# Altium schematic sheet roach2_top.SchDoc: Design Toplevel
size A3; Date: DO NOT USE, RATHER USE PROJ OPTIONS; DrawnBy: DO NOT USE, RATHER USE PROJ OPTIONS; Engineer: DO NOT USE, RATHER USE PROJ OPTIONS; Organization: DO NOT USE, RATHER USE PROJ OPTIONS; DocumentNumber: DO NOT USE, RATHER USE PROJ OPTIONS; Revision: DO NOT USE, RATHER USE PROJ OPTIONS; SheetNumber: 1; SheetTotal: 27; SCH_Sheet_Filename: <roach2_top.SchDoc>; CurrentTime: DO NOT USE, RATHER USE PROJ OPTIONS; Time: DO NOT USE, RATHER USE PROJ OPTIONS; DocumentFullPathAndName: DO NOT USE, RATHER USE PROJ OPTIONS; DocumentName: DO NOT USE, RATHER USE PROJ OPTIONS; ModifiedDate: DO NOT USE, RATHER USE PROJ OPTIONS; ImagePath: DO NOT USE, RATHER USE PROJ OPTIONS
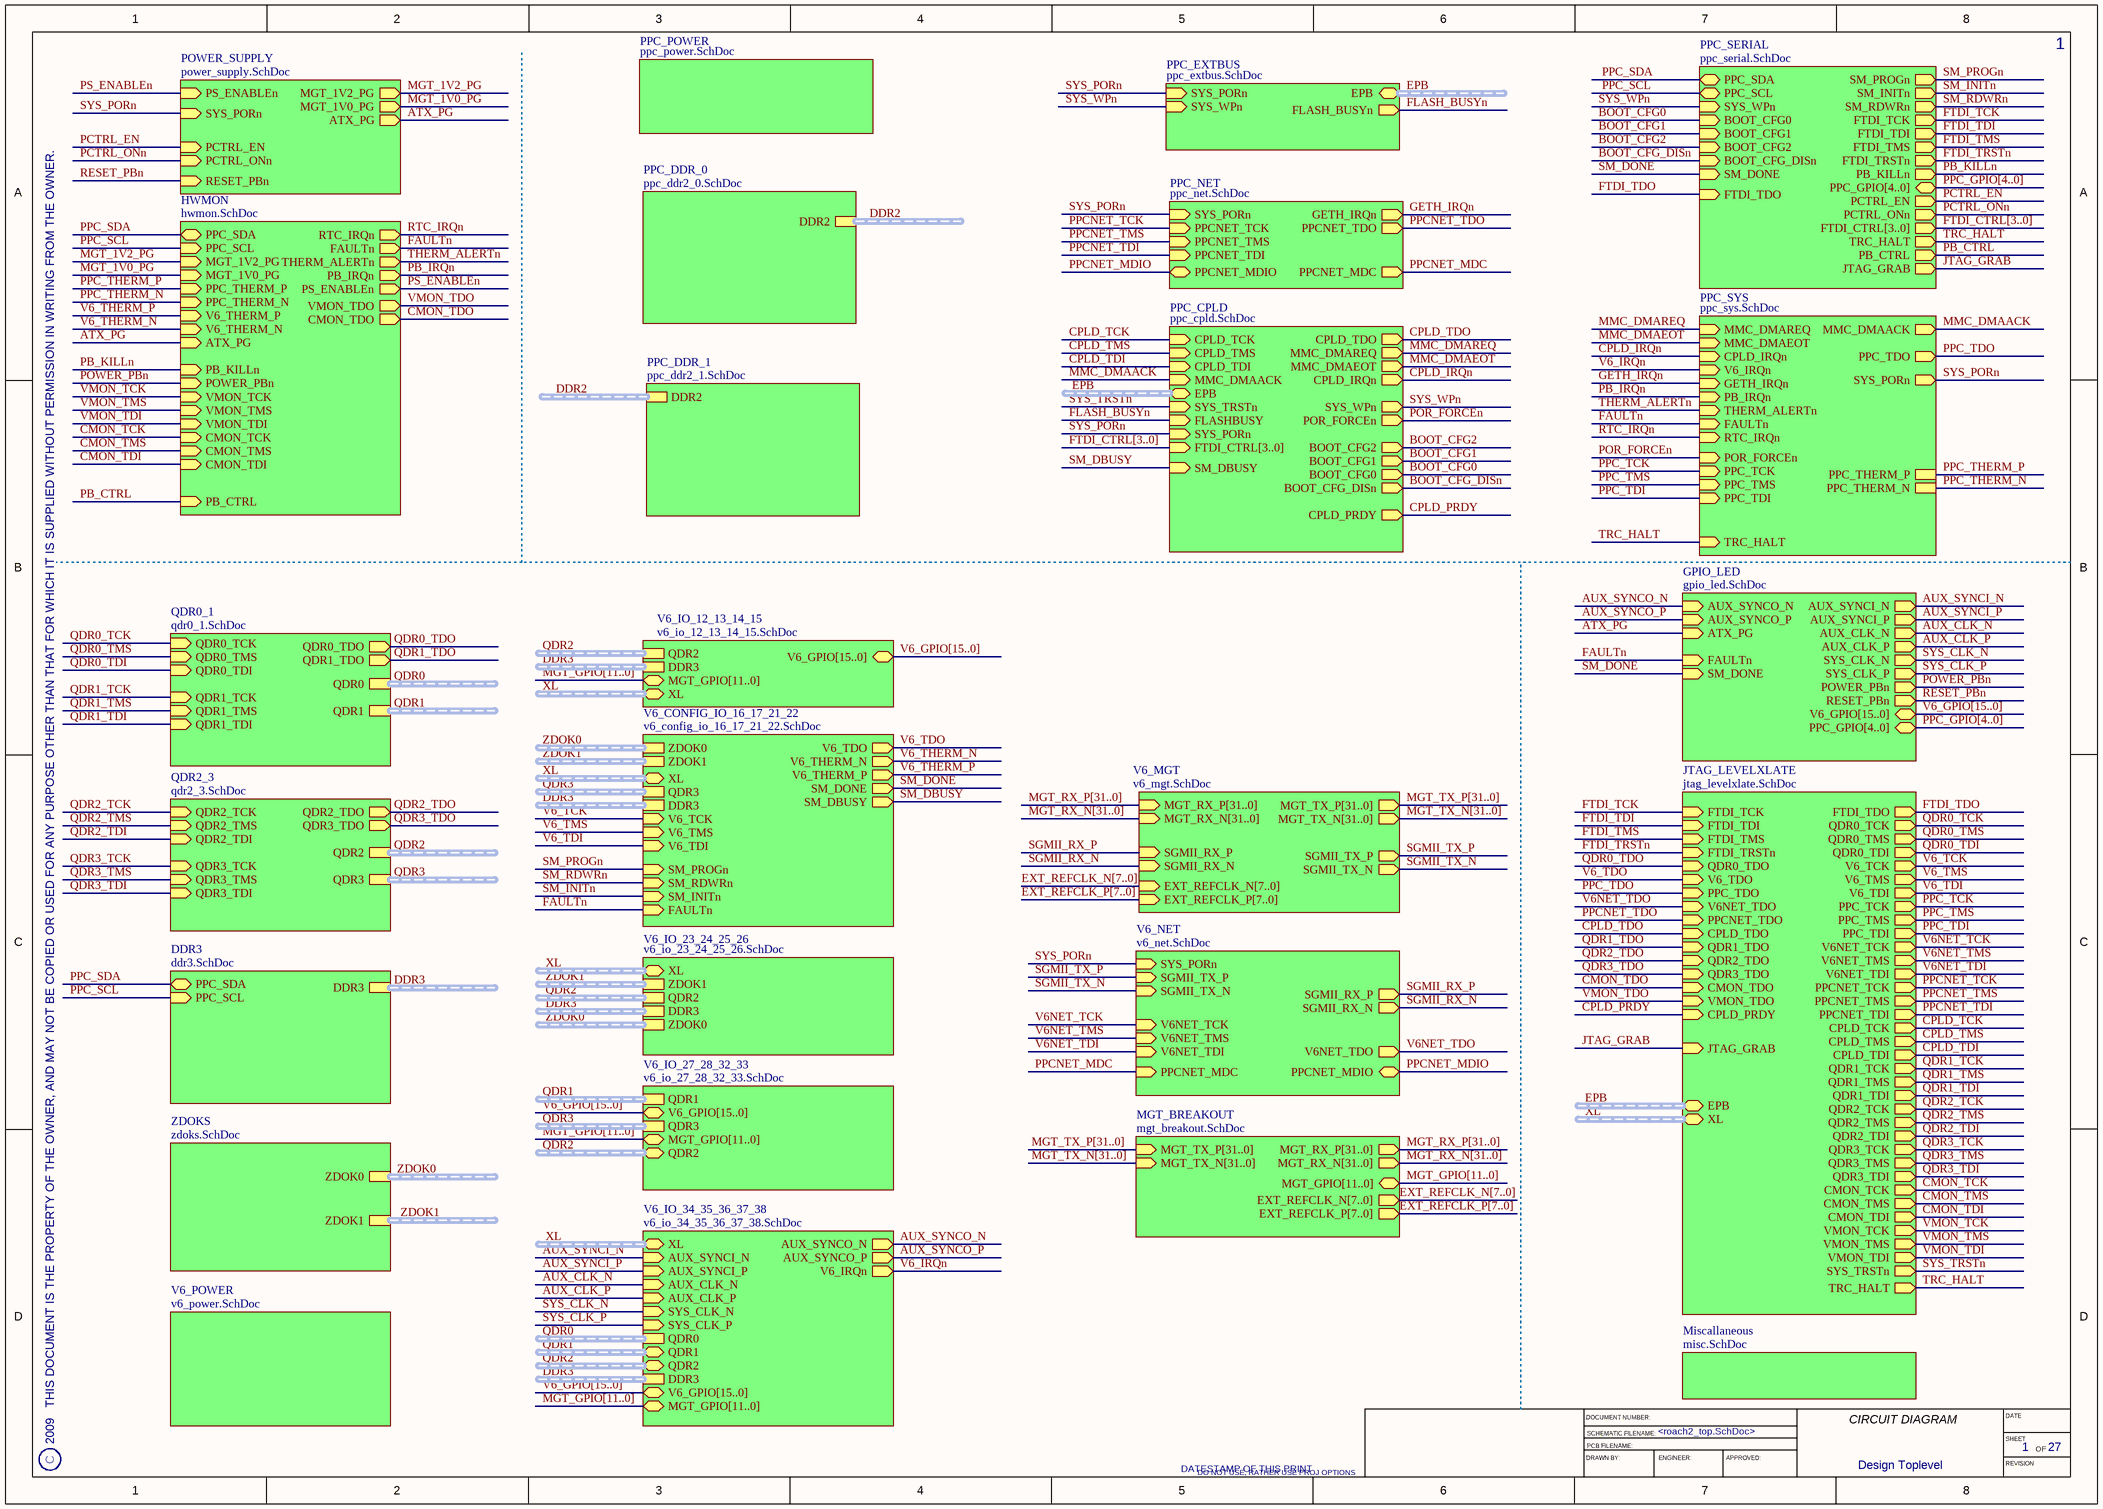
[diagram p0: roach2_top.SchDoc]

## Sub-sheets
DDR3 = ddr3.SchDoc: DDR3 (harness DDR3), PPC_SDA (bidir), PPC_SCL (in)
GPIO_LED = gpio_led.SchDoc: V6_GPIO[15..0] (bidir), AUX_SYNCO_N (in), AUX_SYNCO_P (in), AUX_SYNCI_N (out), AUX_SYNCI_P (out), AUX_CLK_N (out), AUX_CLK_P (out), POWER_PBn (out), ATX_PG (in), RESET_PBn (out), PPC_GPIO[4..0] (bidir), SYS_CLK_N (out), SYS_CLK_P (out), SM_DONE (in), FAULTn (in)
HWMON = hwmon.SchDoc: PPC_SDA (bidir), PPC_SCL (in), RTC_IRQn (out), MGT_1V2_PG (in), MGT_1V0_PG (in), PPC_THERM_P (in), PPC_THERM_N (in), V6_THERM_P (in), V6_THERM_N (in), FAULTn (out), THERM_ALERTn (out), ATX_PG (in), PB_IRQn (out), PB_KILLn (in), POWER_PBn (in), PS_ENABLEn (out), VMON_TDO (out), CMON_TDO (out), VMON_TCK (in), VMON_TMS (in), VMON_TDI (in), CMON_TCK (in), CMON_TMS (in), CMON_TDI (in), PB_CTRL (in)
JTAG_LEVELXLATE = jtag_levelxlate.SchDoc: FTDI_TCK (in), FTDI_TDI (in), FTDI_TMS (in), FTDI_TRSTn (in), FTDI_TDO (out), QDR0_TCK (out), QDR0_TMS (out), QDR0_TDI (out), QDR0_TDO (in), V6_TCK (out), V6_TDI (out), V6_TMS (out), V6_TDO (in), PPC_TDI (out), PPC_TDO (in), PPC_TMS (out), PPC_TCK (out), V6NET_TDI (out), V6NET_TDO (in), V6NET_TCK (out), V6NET_TMS (out), PPCNET_TDI (out), PPCNET_TDO (in), PPCNET_TCK (out), PPCNET_TMS (out), CPLD_TDI (out), CPLD_TDO (in), CPLD_TCK (out), CPLD_TMS (out), QDR1_TCK (out), QDR1_TMS (out), QDR1_TDI (out), QDR1_TDO (in), QDR2_TCK (out), QDR2_TMS (out), QDR2_TDI (out), QDR2_TDO (in), QDR3_TCK (out), QDR3_TMS (out), QDR3_TDI (out), QDR3_TDO (in), SYS_TRSTn (out), CMON_TMS (out), VMON_TMS (out), CMON_TCK (out), VMON_TCK (out), CMON_TDO (in), VMON_TDO (in), CMON_TDI (out), VMON_TDI (out), EPB (harness EPB), XL (harness XL), CPLD_PRDY (in), TRC_HALT (out), JTAG_GRAB (in)
MGT_BREAKOUT = mgt_breakout.SchDoc: MGT_RX_P[31..0] (out), MGT_RX_N[31..0] (out), MGT_TX_P[31..0] (in), MGT_TX_N[31..0] (in), MGT_GPIO[11..0] (bidir), EXT_REFCLK_N[7..0] (out), EXT_REFCLK_P[7..0] (out)
Miscallaneous = misc.SchDoc: no entries
POWER_SUPPLY = power_supply.SchDoc: PS_ENABLEn (in), MGT_1V2_PG (out), MGT_1V0_PG (out), ATX_PG (out), SYS_PORn (in), PCTRL_EN (in), PCTRL_ONn (in), RESET_PBn (in)
PPC_CPLD = ppc_cpld.SchDoc: CPLD_TDI (in), CPLD_TDO (out), CPLD_TCK (in), CPLD_TMS (in), MMC_DMAREQ (out), MMC_DMAACK (in), MMC_DMAEOT (out), CPLD_IRQn (out), SYS_TRSTn (in), SYS_WPn (out), FLASHBUSY (in), POR_FORCEn (out), BOOT_CFG_DISn (out), BOOT_CFG2 (out), BOOT_CFG1 (out), BOOT_CFG0 (out), SYS_PORn (in), EPB (harness EPB), FTDI_CTRL[3..0] (in), CPLD_PRDY (out), SM_DBUSY (in)
PPC_DDR_0 = ppc_ddr2_0.SchDoc: DDR2 (harness DDR2)
PPC_DDR_1 = ppc_ddr2_1.SchDoc: DDR2 (harness DDR2)
PPC_EXTBUS = ppc_extbus.SchDoc: SYS_PORn (in), SYS_WPn (in), FLASH_BUSYn (out), EPB (harness EPB)
PPC_NET = ppc_net.SchDoc: SYS_PORn (in), GETH_IRQn (out), PPCNET_TDI (in), PPCNET_TDO (out), PPCNET_TCK (in), PPCNET_TMS (in), PPCNET_MDIO (bidir), PPCNET_MDC (out)
PPC_POWER = ppc_power.SchDoc: no entries
PPC_SERIAL = ppc_serial.SchDoc: PPC_SDA (bidir), PPC_SCL (bidir), SYS_WPn (in), BOOT_CFG0 (in), BOOT_CFG1 (in), BOOT_CFG2 (in), BOOT_CFG_DISn (in), SM_PROGn (out), SM_INITn (out), SM_RDWRn (out), FTDI_TCK (out), FTDI_TDI (out), FTDI_TDO (in), FTDI_TMS (out), FTDI_TRSTn (out), PPC_GPIO[4..0] (bidir), SM_DONE (in), PCTRL_EN (out), PCTRL_ONn (out), PB_KILLn (out), FTDI_CTRL[3..0] (out), TRC_HALT (out), PB_CTRL (out), JTAG_GRAB (out)
PPC_SYS = ppc_sys.SchDoc: MMC_DMAREQ (in), MMC_DMAACK (out), MMC_DMAEOT (in), CPLD_IRQn (in), V6_IRQn (in), GETH_IRQn (in), THERM_ALERTn (in), PPC_THERM_P, PPC_THERM_N, POR_FORCEn (in), PPC_TCK (in), PPC_TDO (out), PPC_TMS (in), PPC_TDI (in), FAULTn (in), SYS_PORn (out), PB_IRQn (in), RTC_IRQn (in), TRC_HALT (in)
QDR0_1 = qdr0_1.SchDoc: QDR0 (harness QDR0), QDR0_TCK (in), QDR0_TMS (in), QDR0_TDI (in), QDR0_TDO (out), QDR1 (harness QDR1), QDR1_TCK (in), QDR1_TMS (in), QDR1_TDI (in), QDR1_TDO (out)
QDR2_3 = qdr2_3.SchDoc: QDR2 (harness QDR2), QDR2_TCK (in), QDR2_TMS (in), QDR2_TDI (in), QDR2_TDO (out), QDR3 (harness QDR3), QDR3_TCK (in), QDR3_TMS (in), QDR3_TDI (in), QDR3_TDO (out)
V6_CONFIG_IO_16_17_21_22 = v6_config_io_16_17_21_22.SchDoc: ZDOK0 (harness ZDOK0), QDR3 (harness QDR3), DDR3 (harness DDR3), V6_TCK (in), V6_TDI (in), V6_TMS (in), V6_TDO (out), V6_THERM_N (out), V6_THERM_P (out), SM_PROGn (in), SM_RDWRn (in), SM_INITn (in), SM_DONE (out), XL (harness XL), FAULTn (in), ZDOK1 (harness ZDOK1), SM_DBUSY (out)
V6_IO_12_13_14_15 = v6_io_12_13_14_15.SchDoc: QDR2 (harness QDR2), DDR3 (harness DDR3), MGT_GPIO[11..0] (bidir), XL (harness XL), V6_GPIO[15..0] (bidir)
V6_IO_23_24_25_26 = v6_io_23_24_25_26.SchDoc: ZDOK1 (harness ZDOK1), QDR2 (harness QDR2), DDR3 (harness DDR3), ZDOK0 (harness ZDOK0), XL (harness XL)
V6_IO_27_28_32_33 = v6_io_27_28_32_33.SchDoc: QDR1 (harness QDR1), V6_GPIO[15..0] (bidir), QDR3 (harness QDR3), MGT_GPIO[11..0] (bidir), QDR2 (harness QDR2)
V6_IO_34_35_36_37_38 = v6_io_34_35_36_37_38.SchDoc: AUX_SYNCO_N (out), AUX_SYNCO_P (out), AUX_SYNCI_N (in), AUX_SYNCI_P (in), V6_IRQn (out), AUX_CLK_N (in), AUX_CLK_P (in), SYS_CLK_N (in), SYS_CLK_P (in), QDR0 (harness QDR0), V6_GPIO[15..0] (bidir), MGT_GPIO[11..0] (bidir), QDR2 (harness QDR2), DDR3 (harness DDR3), QDR1 (harness QDR1), XL (harness XL)
V6_MGT = v6_mgt.SchDoc: MGT_RX_P[31..0] (in), MGT_RX_N[31..0] (in), MGT_TX_P[31..0] (out), MGT_TX_N[31..0] (out), SGMII_RX_P (in), SGMII_RX_N (in), SGMII_TX_P (out), SGMII_TX_N (out), EXT_REFCLK_N[7..0] (in), EXT_REFCLK_P[7..0] (in)
V6_NET = v6_net.SchDoc: SYS_PORn (in), SGMII_TX_P (in), SGMII_TX_N (in), V6NET_TDI (in), V6NET_TDO (out), V6NET_TCK (in), V6NET_TMS (in), SGMII_RX_P (out), SGMII_RX_N (out), PPCNET_MDIO (bidir), PPCNET_MDC (in)
V6_POWER = v6_power.SchDoc: no entries
ZDOKS = zdoks.SchDoc: ZDOK0 (harness ZDOK0), ZDOK1 (harness ZDOK1)

## Nets
ATX_PG: sheet GPIO_LED/ATX_PG, sheet HWMON/ATX_PG, sheet POWER_SUPPLY/ATX_PG
AUX_CLK_N: sheet GPIO_LED/AUX_CLK_N, sheet V6_IO_34_35_36_37_38/AUX_CLK_N
AUX_CLK_P: sheet GPIO_LED/AUX_CLK_P, sheet V6_IO_34_35_36_37_38/AUX_CLK_P
AUX_SYNCI_N: sheet GPIO_LED/AUX_SYNCI_N, sheet V6_IO_34_35_36_37_38/AUX_SYNCI_N
AUX_SYNCI_P: sheet GPIO_LED/AUX_SYNCI_P, sheet V6_IO_34_35_36_37_38/AUX_SYNCI_P
AUX_SYNCO_N: sheet GPIO_LED/AUX_SYNCO_N, sheet V6_IO_34_35_36_37_38/AUX_SYNCO_N
AUX_SYNCO_P: sheet GPIO_LED/AUX_SYNCO_P, sheet V6_IO_34_35_36_37_38/AUX_SYNCO_P
BOOT_CFG0: sheet PPC_CPLD/BOOT_CFG0, sheet PPC_SERIAL/BOOT_CFG0
BOOT_CFG1: sheet PPC_CPLD/BOOT_CFG1, sheet PPC_SERIAL/BOOT_CFG1
BOOT_CFG2: sheet PPC_CPLD/BOOT_CFG2, sheet PPC_SERIAL/BOOT_CFG2
BOOT_CFG_DISn: sheet PPC_CPLD/BOOT_CFG_DISn, sheet PPC_SERIAL/BOOT_CFG_DISn
CMON_TCK: sheet HWMON/CMON_TCK, sheet JTAG_LEVELXLATE/CMON_TCK
CMON_TDI: sheet HWMON/CMON_TDI, sheet JTAG_LEVELXLATE/CMON_TDI
CMON_TDO: sheet HWMON/CMON_TDO, sheet JTAG_LEVELXLATE/CMON_TDO
CMON_TMS: sheet HWMON/CMON_TMS, sheet JTAG_LEVELXLATE/CMON_TMS
CPLD_IRQn: sheet PPC_CPLD/CPLD_IRQn, sheet PPC_SYS/CPLD_IRQn
CPLD_PRDY: sheet JTAG_LEVELXLATE/CPLD_PRDY, sheet PPC_CPLD/CPLD_PRDY
CPLD_TCK: sheet JTAG_LEVELXLATE/CPLD_TCK, sheet PPC_CPLD/CPLD_TCK
CPLD_TDI: sheet JTAG_LEVELXLATE/CPLD_TDI, sheet PPC_CPLD/CPLD_TDI
CPLD_TDO: sheet JTAG_LEVELXLATE/CPLD_TDO, sheet PPC_CPLD/CPLD_TDO
CPLD_TMS: sheet JTAG_LEVELXLATE/CPLD_TMS, sheet PPC_CPLD/CPLD_TMS
FAULTn: sheet GPIO_LED/FAULTn, sheet HWMON/FAULTn, sheet PPC_SYS/FAULTn, sheet V6_CONFIG_IO_16_17_21_22/FAULTn
FLASH_BUSYn: sheet PPC_CPLD/FLASHBUSY, sheet PPC_EXTBUS/FLASH_BUSYn
FTDI_TCK: sheet JTAG_LEVELXLATE/FTDI_TCK, sheet PPC_SERIAL/FTDI_TCK
FTDI_TDI: sheet JTAG_LEVELXLATE/FTDI_TDI, sheet PPC_SERIAL/FTDI_TDI
FTDI_TDO: sheet JTAG_LEVELXLATE/FTDI_TDO, sheet PPC_SERIAL/FTDI_TDO
FTDI_TMS: sheet JTAG_LEVELXLATE/FTDI_TMS, sheet PPC_SERIAL/FTDI_TMS
FTDI_TRSTn: sheet JTAG_LEVELXLATE/FTDI_TRSTn, sheet PPC_SERIAL/FTDI_TRSTn
GETH_IRQn: sheet PPC_NET/GETH_IRQn, sheet PPC_SYS/GETH_IRQn
JTAG_GRAB: sheet JTAG_LEVELXLATE/JTAG_GRAB, sheet PPC_SERIAL/JTAG_GRAB
MGT_1V0_PG: sheet HWMON/MGT_1V0_PG, sheet POWER_SUPPLY/MGT_1V0_PG
MGT_1V2_PG: sheet HWMON/MGT_1V2_PG, sheet POWER_SUPPLY/MGT_1V2_PG
MMC_DMAACK: sheet PPC_CPLD/MMC_DMAACK, sheet PPC_SYS/MMC_DMAACK
MMC_DMAEOT: sheet PPC_CPLD/MMC_DMAEOT, sheet PPC_SYS/MMC_DMAEOT
MMC_DMAREQ: sheet PPC_CPLD/MMC_DMAREQ, sheet PPC_SYS/MMC_DMAREQ
PB_CTRL: sheet HWMON/PB_CTRL, sheet PPC_SERIAL/PB_CTRL
PB_IRQn: sheet HWMON/PB_IRQn, sheet PPC_SYS/PB_IRQn
PB_KILLn: sheet HWMON/PB_KILLn, sheet PPC_SERIAL/PB_KILLn
PCTRL_EN: sheet POWER_SUPPLY/PCTRL_EN, sheet PPC_SERIAL/PCTRL_EN
PCTRL_ONn: sheet POWER_SUPPLY/PCTRL_ONn, sheet PPC_SERIAL/PCTRL_ONn
POR_FORCEn: sheet PPC_CPLD/POR_FORCEn, sheet PPC_SYS/POR_FORCEn
POWER_PBn: sheet GPIO_LED/POWER_PBn, sheet HWMON/POWER_PBn
PPC_SCL: sheet DDR3/PPC_SCL, sheet HWMON/PPC_SCL, sheet PPC_SERIAL/PPC_SCL
PPC_SDA: sheet DDR3/PPC_SDA, sheet HWMON/PPC_SDA, sheet PPC_SERIAL/PPC_SDA
PPC_TCK: sheet JTAG_LEVELXLATE/PPC_TCK, sheet PPC_SYS/PPC_TCK
PPC_TDI: sheet JTAG_LEVELXLATE/PPC_TDI, sheet PPC_SYS/PPC_TDI
PPC_TDO: sheet JTAG_LEVELXLATE/PPC_TDO, sheet PPC_SYS/PPC_TDO
PPC_THERM_N: sheet HWMON/PPC_THERM_N, sheet PPC_SYS/PPC_THERM_N
PPC_THERM_P: sheet HWMON/PPC_THERM_P, sheet PPC_SYS/PPC_THERM_P
PPC_TMS: sheet JTAG_LEVELXLATE/PPC_TMS, sheet PPC_SYS/PPC_TMS
PPCNET_MDC: sheet PPC_NET/PPCNET_MDC, sheet V6_NET/PPCNET_MDC
PPCNET_MDIO: sheet PPC_NET/PPCNET_MDIO, sheet V6_NET/PPCNET_MDIO
PPCNET_TCK: sheet JTAG_LEVELXLATE/PPCNET_TCK, sheet PPC_NET/PPCNET_TCK
PPCNET_TDI: sheet JTAG_LEVELXLATE/PPCNET_TDI, sheet PPC_NET/PPCNET_TDI
PPCNET_TDO: sheet JTAG_LEVELXLATE/PPCNET_TDO, sheet PPC_NET/PPCNET_TDO
PPCNET_TMS: sheet JTAG_LEVELXLATE/PPCNET_TMS, sheet PPC_NET/PPCNET_TMS
PS_ENABLEn: sheet HWMON/PS_ENABLEn, sheet POWER_SUPPLY/PS_ENABLEn
QDR0_TCK: sheet JTAG_LEVELXLATE/QDR0_TCK, sheet QDR0_1/QDR0_TCK
QDR0_TDI: sheet JTAG_LEVELXLATE/QDR0_TDI, sheet QDR0_1/QDR0_TDI
QDR0_TDO: sheet JTAG_LEVELXLATE/QDR0_TDO, sheet QDR0_1/QDR0_TDO
QDR0_TMS: sheet JTAG_LEVELXLATE/QDR0_TMS, sheet QDR0_1/QDR0_TMS
QDR1_TCK: sheet JTAG_LEVELXLATE/QDR1_TCK, sheet QDR0_1/QDR1_TCK
QDR1_TDI: sheet JTAG_LEVELXLATE/QDR1_TDI, sheet QDR0_1/QDR1_TDI
QDR1_TDO: sheet JTAG_LEVELXLATE/QDR1_TDO, sheet QDR0_1/QDR1_TDO
QDR1_TMS: sheet JTAG_LEVELXLATE/QDR1_TMS, sheet QDR0_1/QDR1_TMS
QDR2_TCK: sheet JTAG_LEVELXLATE/QDR2_TCK, sheet QDR2_3/QDR2_TCK
QDR2_TDI: sheet JTAG_LEVELXLATE/QDR2_TDI, sheet QDR2_3/QDR2_TDI
QDR2_TDO: sheet JTAG_LEVELXLATE/QDR2_TDO, sheet QDR2_3/QDR2_TDO
QDR2_TMS: sheet JTAG_LEVELXLATE/QDR2_TMS, sheet QDR2_3/QDR2_TMS
QDR3_TCK: sheet JTAG_LEVELXLATE/QDR3_TCK, sheet QDR2_3/QDR3_TCK
QDR3_TDI: sheet JTAG_LEVELXLATE/QDR3_TDI, sheet QDR2_3/QDR3_TDI
QDR3_TDO: sheet JTAG_LEVELXLATE/QDR3_TDO, sheet QDR2_3/QDR3_TDO
QDR3_TMS: sheet JTAG_LEVELXLATE/QDR3_TMS, sheet QDR2_3/QDR3_TMS
RESET_PBn: sheet GPIO_LED/RESET_PBn, sheet POWER_SUPPLY/RESET_PBn
RTC_IRQn: sheet HWMON/RTC_IRQn, sheet PPC_SYS/RTC_IRQn
SGMII_RX_N: sheet V6_MGT/SGMII_RX_N, sheet V6_NET/SGMII_RX_N
SGMII_RX_P: sheet V6_MGT/SGMII_RX_P, sheet V6_NET/SGMII_RX_P
SGMII_TX_N: sheet V6_MGT/SGMII_TX_N, sheet V6_NET/SGMII_TX_N
SGMII_TX_P: sheet V6_MGT/SGMII_TX_P, sheet V6_NET/SGMII_TX_P
SM_DBUSY: sheet PPC_CPLD/SM_DBUSY, sheet V6_CONFIG_IO_16_17_21_22/SM_DBUSY
SM_DONE: sheet GPIO_LED/SM_DONE, sheet PPC_SERIAL/SM_DONE, sheet V6_CONFIG_IO_16_17_21_22/SM_DONE
SM_INITn: sheet PPC_SERIAL/SM_INITn, sheet V6_CONFIG_IO_16_17_21_22/SM_INITn
SM_PROGn: sheet PPC_SERIAL/SM_PROGn, sheet V6_CONFIG_IO_16_17_21_22/SM_PROGn
SM_RDWRn: sheet PPC_SERIAL/SM_RDWRn, sheet V6_CONFIG_IO_16_17_21_22/SM_RDWRn
SYS_CLK_N: sheet GPIO_LED/SYS_CLK_N, sheet V6_IO_34_35_36_37_38/SYS_CLK_N
SYS_CLK_P: sheet GPIO_LED/SYS_CLK_P, sheet V6_IO_34_35_36_37_38/SYS_CLK_P
SYS_PORn: sheet POWER_SUPPLY/SYS_PORn, sheet PPC_CPLD/SYS_PORn, sheet PPC_EXTBUS/SYS_PORn, sheet PPC_NET/SYS_PORn, sheet PPC_SYS/SYS_PORn, sheet V6_NET/SYS_PORn
SYS_TRSTn: sheet JTAG_LEVELXLATE/SYS_TRSTn, sheet PPC_CPLD/SYS_TRSTn
SYS_WPn: sheet PPC_CPLD/SYS_WPn, sheet PPC_EXTBUS/SYS_WPn, sheet PPC_SERIAL/SYS_WPn
THERM_ALERTn: sheet HWMON/THERM_ALERTn, sheet PPC_SYS/THERM_ALERTn
TRC_HALT: sheet JTAG_LEVELXLATE/TRC_HALT, sheet PPC_SERIAL/TRC_HALT, sheet PPC_SYS/TRC_HALT
V6_IRQn: sheet PPC_SYS/V6_IRQn, sheet V6_IO_34_35_36_37_38/V6_IRQn
V6_TCK: sheet JTAG_LEVELXLATE/V6_TCK, sheet V6_CONFIG_IO_16_17_21_22/V6_TCK
V6_TDI: sheet JTAG_LEVELXLATE/V6_TDI, sheet V6_CONFIG_IO_16_17_21_22/V6_TDI
V6_TDO: sheet JTAG_LEVELXLATE/V6_TDO, sheet V6_CONFIG_IO_16_17_21_22/V6_TDO
V6_THERM_N: sheet HWMON/V6_THERM_N, sheet V6_CONFIG_IO_16_17_21_22/V6_THERM_N
V6_THERM_P: sheet HWMON/V6_THERM_P, sheet V6_CONFIG_IO_16_17_21_22/V6_THERM_P
V6_TMS: sheet JTAG_LEVELXLATE/V6_TMS, sheet V6_CONFIG_IO_16_17_21_22/V6_TMS
V6NET_TCK: sheet JTAG_LEVELXLATE/V6NET_TCK, sheet V6_NET/V6NET_TCK
V6NET_TDI: sheet JTAG_LEVELXLATE/V6NET_TDI, sheet V6_NET/V6NET_TDI
V6NET_TDO: sheet JTAG_LEVELXLATE/V6NET_TDO, sheet V6_NET/V6NET_TDO
V6NET_TMS: sheet JTAG_LEVELXLATE/V6NET_TMS, sheet V6_NET/V6NET_TMS
VMON_TCK: sheet HWMON/VMON_TCK, sheet JTAG_LEVELXLATE/VMON_TCK
VMON_TDI: sheet HWMON/VMON_TDI, sheet JTAG_LEVELXLATE/VMON_TDI
VMON_TDO: sheet HWMON/VMON_TDO, sheet JTAG_LEVELXLATE/VMON_TDO
VMON_TMS: sheet HWMON/VMON_TMS, sheet JTAG_LEVELXLATE/VMON_TMS

## Buses and harness runs
bus EXT_REFCLK_N[7..0] = sheet MGT_BREAKOUT/EXT_REFCLK_N[7..0]
bus EXT_REFCLK_N[7..0] = sheet V6_MGT/EXT_REFCLK_N[7..0]
bus EXT_REFCLK_P[7..0] = sheet MGT_BREAKOUT/EXT_REFCLK_P[7..0]
bus EXT_REFCLK_P[7..0] = sheet V6_MGT/EXT_REFCLK_P[7..0]
bus FTDI_CTRL[3..0] = sheet PPC_CPLD/FTDI_CTRL[3..0]
bus FTDI_CTRL[3..0] = sheet PPC_SERIAL/FTDI_CTRL[3..0]
bus MGT_GPIO[11..0] = sheet MGT_BREAKOUT/MGT_GPIO[11..0]
bus MGT_GPIO[11..0] = sheet V6_IO_12_13_14_15/MGT_GPIO[11..0]
bus MGT_GPIO[11..0] = sheet V6_IO_27_28_32_33/MGT_GPIO[11..0]
bus MGT_GPIO[11..0] = sheet V6_IO_34_35_36_37_38/MGT_GPIO[11..0]
bus MGT_RX_N[31..0] = sheet MGT_BREAKOUT/MGT_RX_N[31..0]
bus MGT_RX_N[31..0] = sheet V6_MGT/MGT_RX_N[31..0]
bus MGT_RX_P[31..0] = sheet MGT_BREAKOUT/MGT_RX_P[31..0]
bus MGT_RX_P[31..0] = sheet V6_MGT/MGT_RX_P[31..0]
bus MGT_TX_N[31..0] = sheet MGT_BREAKOUT/MGT_TX_N[31..0]
bus MGT_TX_N[31..0] = sheet V6_MGT/MGT_TX_N[31..0]
bus MGT_TX_P[31..0] = sheet MGT_BREAKOUT/MGT_TX_P[31..0]
bus MGT_TX_P[31..0] = sheet V6_MGT/MGT_TX_P[31..0]
bus PPC_GPIO[4..0] = sheet GPIO_LED/PPC_GPIO[4..0]
bus PPC_GPIO[4..0] = sheet PPC_SERIAL/PPC_GPIO[4..0]
bus V6_GPIO[15..0] = sheet GPIO_LED/V6_GPIO[15..0]
bus V6_GPIO[15..0] = sheet V6_IO_12_13_14_15/V6_GPIO[15..0]
bus V6_GPIO[15..0] = sheet V6_IO_27_28_32_33/V6_GPIO[15..0]
bus V6_GPIO[15..0] = sheet V6_IO_34_35_36_37_38/V6_GPIO[15..0]
harness DDR2 = sheet PPC_DDR_0/DDR2
harness DDR2 = sheet PPC_DDR_1/DDR2
harness DDR3 = sheet DDR3/DDR3
harness DDR3 = sheet V6_CONFIG_IO_16_17_21_22/DDR3
harness DDR3 = sheet V6_IO_12_13_14_15/DDR3
harness DDR3 = sheet V6_IO_23_24_25_26/DDR3
harness DDR3 = sheet V6_IO_34_35_36_37_38/DDR3
harness EPB = sheet JTAG_LEVELXLATE/EPB
harness EPB = sheet PPC_CPLD/EPB
harness EPB = sheet PPC_EXTBUS/EPB
harness QDR0 = sheet QDR0_1/QDR0
harness QDR0 = sheet V6_IO_34_35_36_37_38/QDR0
harness QDR1 = sheet QDR0_1/QDR1
harness QDR1 = sheet V6_IO_27_28_32_33/QDR1
harness QDR1 = sheet V6_IO_34_35_36_37_38/QDR1
harness QDR2 = sheet QDR2_3/QDR2
harness QDR2 = sheet V6_IO_12_13_14_15/QDR2
harness QDR2 = sheet V6_IO_23_24_25_26/QDR2
harness QDR2 = sheet V6_IO_27_28_32_33/QDR2
harness QDR2 = sheet V6_IO_34_35_36_37_38/QDR2
harness QDR3 = sheet QDR2_3/QDR3
harness QDR3 = sheet V6_CONFIG_IO_16_17_21_22/QDR3
harness QDR3 = sheet V6_IO_27_28_32_33/QDR3
harness XL = sheet JTAG_LEVELXLATE/XL
harness XL = sheet V6_CONFIG_IO_16_17_21_22/XL
harness XL = sheet V6_IO_12_13_14_15/XL
harness XL = sheet V6_IO_23_24_25_26/XL
harness XL = sheet V6_IO_34_35_36_37_38/XL
harness ZDOK0 = sheet V6_CONFIG_IO_16_17_21_22/ZDOK0
harness ZDOK0 = sheet V6_IO_23_24_25_26/ZDOK0
harness ZDOK0 = sheet ZDOKS/ZDOK0
harness ZDOK1 = sheet V6_CONFIG_IO_16_17_21_22/ZDOK1
harness ZDOK1 = sheet V6_IO_23_24_25_26/ZDOK1
harness ZDOK1 = sheet ZDOKS/ZDOK1

## Notes on the sheet
- 2009   THIS DOCUMENT IS THE PROPERTY OF THE OWNER, AND MAY NOT BE COPIED OR USED FOR ANY PURPOSE OTHER THAN THAT FOR WHICH IT IS SUPPLIED WITHOUT PERMISSION IN WRITING FROM THE OWNER.
- C
- DATESTAMP OF THIS PRINT
- DRAWN BY:
- DOCUMENT NUMBER:
- SCHEMATIC FILENAME:
- PCB FILENAME:
- ENGINEER:
- APPROVED:
- CIRCUIT DIAGRAM
- DATE
- SHEET
- REVISION
- OF